# EAGLE design MultiSensor_MPL_TCA_0805 (EAGLE 9.5.2)
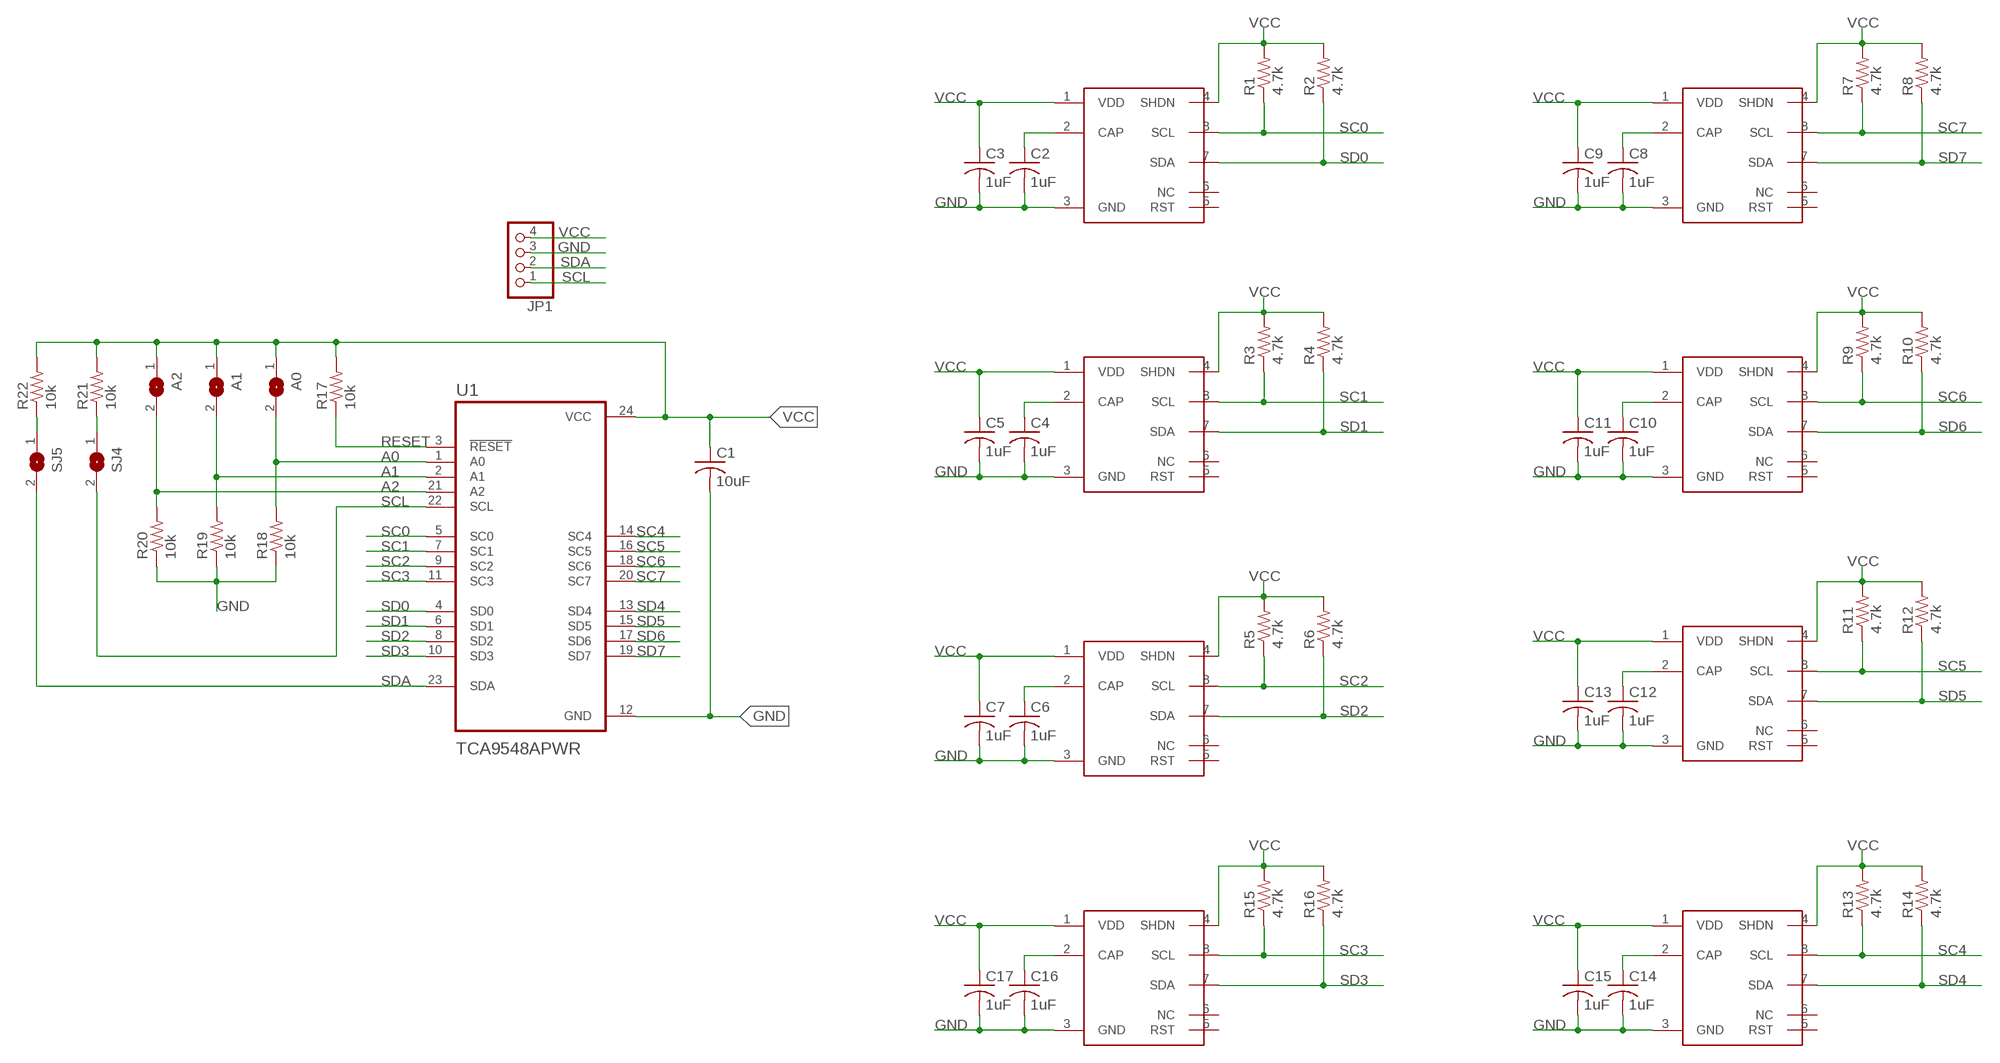
[diagram p0: schematic, sheet 1]

## Parts
A0  SJ  [SJ]
A1  SJ  [SJ]
A2  SJ  [SJ]
B1  MPL115A2T1  [MPL115A2T1]
B2  MPL115A2T1  [MPL115A2T1]
B3  MPL115A2T1  [MPL115A2T1]
B4  MPL115A2T1  [MPL115A2T1]
B5  MPL115A2T1  [MPL115A2T1]
B6  MPL115A2T1  [MPL115A2T1]
B7  MPL115A2T1  [MPL115A2T1]
B8  MPL115A2T1  [MPL115A2T1]
C1  10uF  C-USC1206  [C1206]
C2  1uF  C-USC0805  [C0805]
C3  1uF  C-USC0805  [C0805]
C4  1uF  C-USC0805  [C0805]
C5  1uF  C-USC0805  [C0805]
C6  1uF  C-USC0805  [C0805]
C7  1uF  C-USC0805  [C0805]
C8  1uF  C-USC0805  [C0805]
C9  1uF  C-USC0805  [C0805]
C10  1uF  C-USC0805  [C0805]
C11  1uF  C-USC0805  [C0805]
C12  1uF  C-USC0805  [C0805]
C13  1uF  C-USC0805  [C0805]
C14  1uF  C-USC0805  [C0805]
C15  1uF  C-USC0805  [C0805]
C16  1uF  C-USC0805  [C0805]
C17  1uF  C-USC0805  [C0805]
JP1  PINHD-1X4  [1X04]
R1  4.7k  R-US_R0805  [R0805]
R2  4.7k  R-US_R0805  [R0805]
R3  4.7k  R-US_R0805  [R0805]
R4  4.7k  R-US_R0805  [R0805]
R5  4.7k  R-US_R0805  [R0805]
R6  4.7k  R-US_R0805  [R0805]
R7  4.7k  R-US_R0805  [R0805]
R8  4.7k  R-US_R0805  [R0805]
R9  4.7k  R-US_R0805  [R0805]
R10  4.7k  R-US_R0805  [R0805]
R11  4.7k  R-US_R0805  [R0805]
R12  4.7k  R-US_R0805  [R0805]
R13  4.7k  R-US_R0805  [R0805]
R14  4.7k  R-US_R0805  [R0805]
R15  4.7k  R-US_R0805  [R0805]
R16  4.7k  R-US_R0805  [R0805]
R17  10k  R-US_R0805  [R0805]
R18  10k  R-US_R0805  [R0805]
R19  10k  R-US_R0805  [R0805]
R20  10k  R-US_R0805  [R0805]
R21  10k  R-US_R0805  [R0805]
R22  10k  R-US_R0805  [R0805]
SJ4  SJ  [SJ]
SJ5  SJ  [SJ]
U1  TCA9548APWR  [SOP65P640X120-24N]

## Nets
A0: A0.2 R18.2 U1.1(A0)
A1: A1.2 R19.2 U1.2(A1)
A2: A2.2 R20.2 U1.21(A2)
CAP1: B1.2(CAP) C2.1
CAP2: B2.2(CAP) C4.1
CAP3: B3.2(CAP) C6.1
CAP4: B8.2(CAP) C16.1
CAP5: B7.2(CAP) C14.1
CAP6: B6.2(CAP) C12.1
CAP7: B5.2(CAP) C10.1
CAP8: B4.2(CAP) C8.1
GND: B1.3(GND) B2.3(GND) B3.3(GND) B4.3(GND) B5.3(GND) B6.3(GND) B7.3(GND) B8.3(GND) C1.2 C2.2 C3.2 C4.2 C5.2 C6.2 C7.2 C8.2 C9.2 C10.2 C11.2 C12.2 C13.2 C14.2 C15.2 C16.2 C17.2 JP1.3 R18.1 R19.1 R20.1 U1.12(GND)
N$1: R22.1 SJ5.1
N$2: R21.1 SJ4.1
RESET: R17.1 U1.3(!RESET)
SC0: B1.8(SCL) R1.1 U1.5(SC0)
SC1: B2.8(SCL) R3.1 U1.7(SC1)
SC2: B3.8(SCL) R5.1 U1.9(SC2)
SC3: B8.8(SCL) R15.1 U1.11(SC3)
SC4: B7.8(SCL) R13.1 U1.14(SC4)
SC5: B6.8(SCL) R11.1 U1.16(SC5)
SC6: B5.8(SCL) R9.1 U1.18(SC6)
SC7: B4.8(SCL) R7.1 U1.20(SC7)
SCL: JP1.1 SJ4.2 U1.22(SCL)
SD0: B1.7(SDA) R2.1 U1.4(SD0)
SD1: B2.7(SDA) R4.1 U1.6(SD1)
SD2: B3.7(SDA) R6.1 U1.8(SD2)
SD3: B8.7(SDA) R16.1 U1.10(SD3)
SD4: B7.7(SDA) R14.1 U1.13(SD4)
SD5: B6.7(SDA) R12.1 U1.15(SD5)
SD6: B5.7(SDA) R10.1 U1.17(SD6)
SD7: B4.7(SDA) R8.1 U1.19(SD7)
SDA: JP1.2 SJ5.2 U1.23(SDA)
VCC: A0.1 A1.1 A2.1 B1.1(VDD) B1.4(SHDN) B2.1(VDD) B2.4(SHDN) B3.1(VDD) B3.4(SHDN) B4.1(VDD) B4.4(SHDN) B5.1(VDD) B5.4(SHDN) B6.1(VDD) B6.4(SHDN) B7.1(VDD) B7.4(SHDN) B8.1(VDD) B8.4(SHDN) C1.1 C3.1 C5.1 C7.1 C9.1 C11.1 C13.1 C15.1 C17.1 JP1.4 R1.2 R2.2 R3.2 R4.2 R5.2 R6.2 R7.2 R8.2 R9.2 R10.2 R11.2 R12.2 R13.2 R14.2 R15.2 R16.2 R17.2 R21.2 R22.2 U1.24(VCC)
Unconnected: B1.5(RST) B1.6(NC) B2.5(RST) B2.6(NC) B3.5(RST) B3.6(NC) B4.5(RST) B4.6(NC) B5.5(RST) B5.6(NC) B6.5(RST) B6.6(NC) B7.5(RST) B7.6(NC) B8.5(RST) B8.6(NC)

## Library data of the parts
A0 A1 A2 SJ4 SJ5 = jumper:SJ: SMD solder JUMPER
B1-B8 = MPL115A2T1:MPL115A2T1: MEMS Barometer from NXP Semiconductors. DATASHEET: https://www.nxp.com/docs/en/data-sheet/MPL115A2.pdf
C1-C17 = rcl:C-US: CAPACITOR, American symbol; SPICEPREFIX: C
JP1 = pinhead:PINHD-1X4: PIN HEADER
R1-R16 = rcl:R-US_: RESISTOR, American symbol; SPICEPREFIX: R
R17-R22 = resistor:R-US_: RESISTOR, American symbol
U1 = TCA9548APWR:TCA9548APWR; DESCRIPTION: Low-Voltage 8-Channel I2C Switch With Reset 24-TSSOP -40 to 85; DIGI-KEY_PART_NUMBER: 296-34905-1-ND; MF: Texas Instruments; MP: TCA9548APWR; PACKAGE: TSSOP-24 Texas Instruments; PURCHASE-URL: https://pricing.snapeda.com/search/part/TCA9548APWR/?ref=eda

## Board
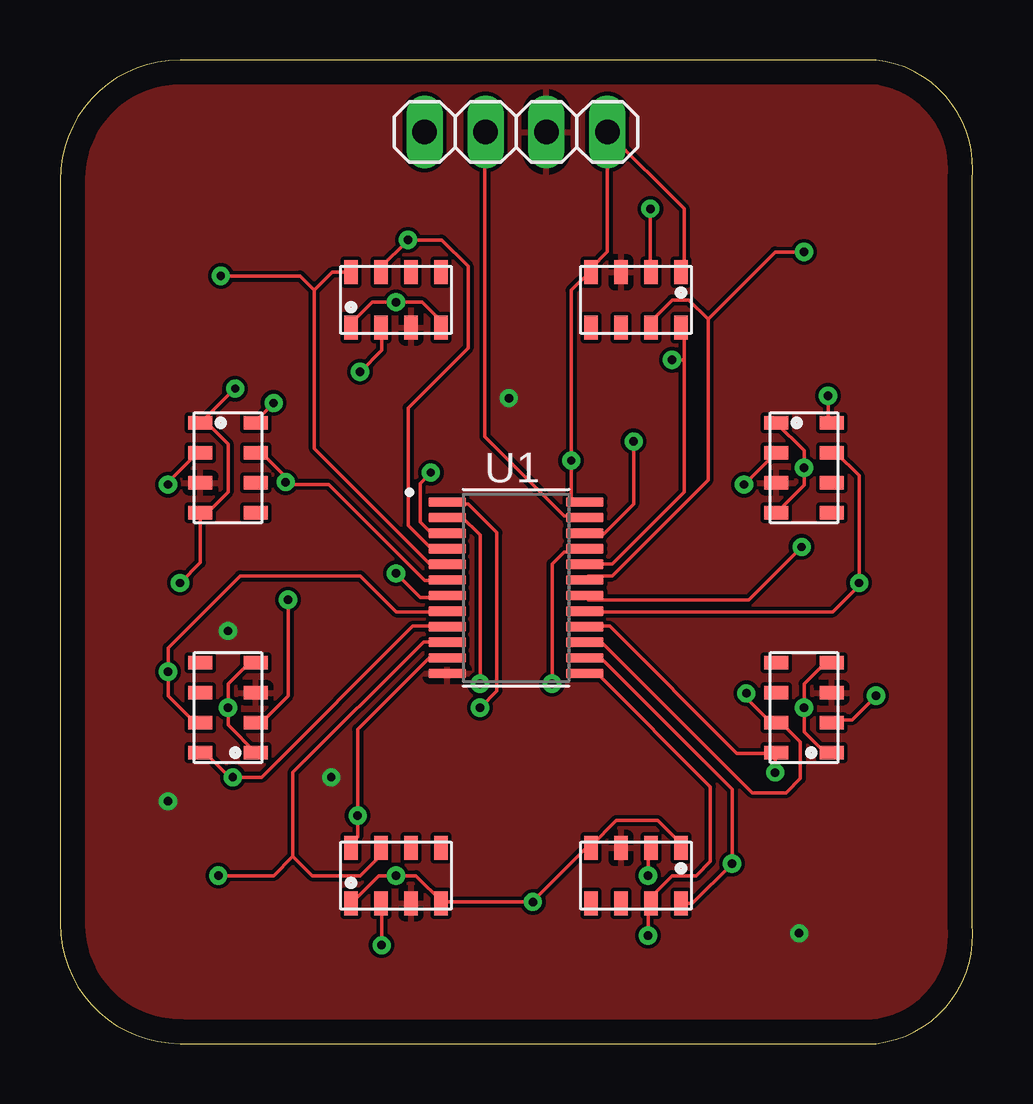
[diagram p1: board, top side]
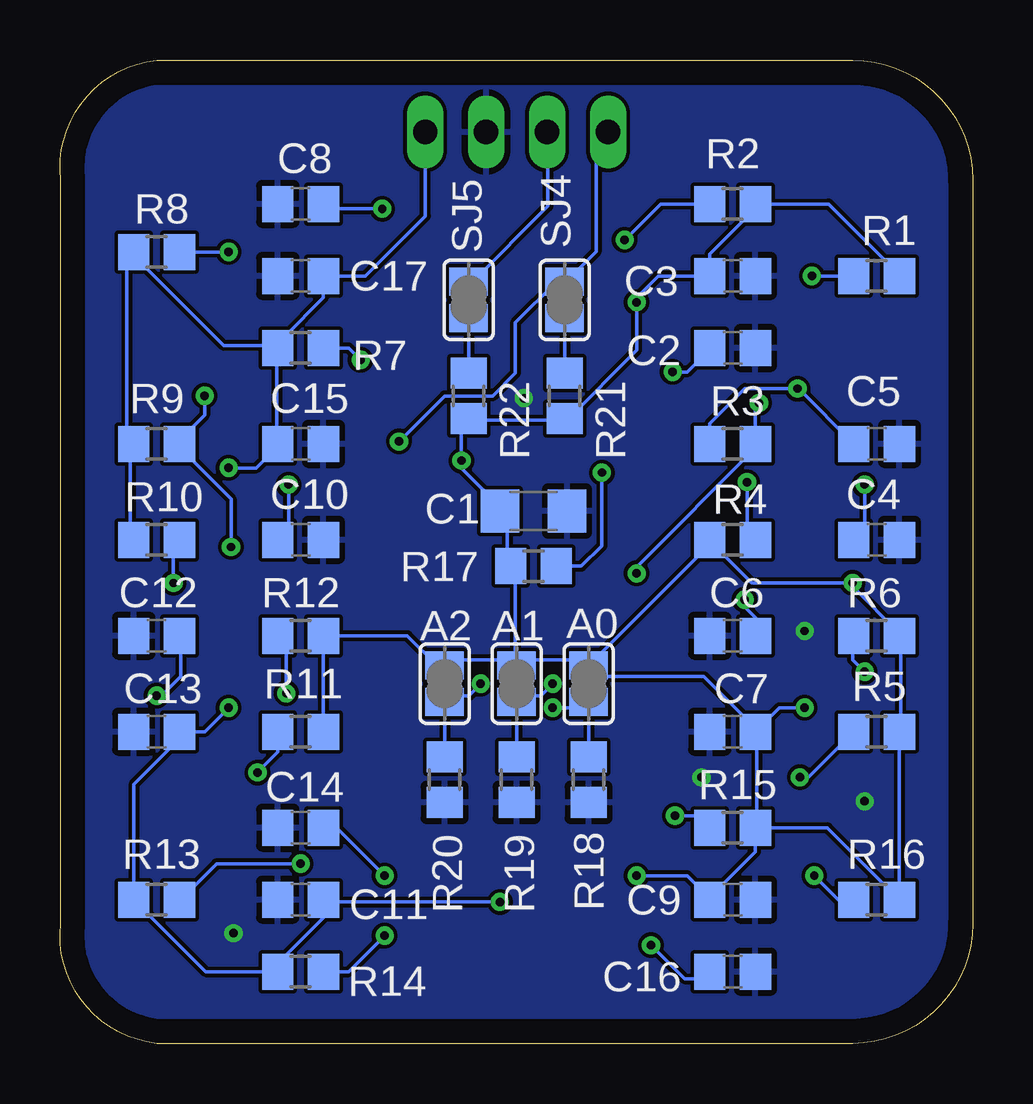
[diagram p2: board, bottom side, seen from below]

Size 38.03 x 41 mm. Coordinates in mm from the lower left corner, seen from the top.
Outline: 0,36 0,5 arc90 5,0 34,0 arc90 38,5 38,36 arc90 34,41 5,41 arc90 0,36
Copper layers (1*16): Top 0.035mm / dielectric 1.5mm / Bottom 0.035mm
Design rules "default": minimum track width 6mil, minimum drill 0.35mm, track to track 6mil, track to pad 6mil, pad to pad 6mil, via to via 6mil, smd to smd 6mil, copper to edge 40mil, drill to drill 6mil, minimum pad ring 10mil, minimum via ring 8mil, stop-mask expansion 4mil, vias tented up to drill 0mil, thermal gap 10mil

### Footprints (pad centres in the part's own frame; a part is rotated, then mirrored left to right if it is on the bottom)
SJ = smd 1.168 x 1.6: 1 -0.762,0; 2 0.762,0
MPL115A2T1 = smd 1 x 0.55: 1 -1.15,1.875; 2 -1.15,0.625; 3 -1.15,-0.625; 4 -1.15,-1.875; 5 1.15,-1.875; 6 1.15,-0.625; 7 1.15,0.625; 8 1.15,1.875
C1206 = smd 1.6 x 1.8: 1 -1.4,0; 2 1.4,0
C0805 = smd 1.3 x 1.5: 1 -0.95,0; 2 0.95,0
1X04 = drill 1.016 long: 1 -3.81,0; 2 -1.27,0; 3 1.27,0; 4 3.81,0
R0805 = smd 1.3 x 1.5: 1 -0.95,0; 2 0.95,0
SOP65P640X120-24N = smd 1.57 x 0.41: 1 -2.87,3.575; 2 -2.87,2.925; 3 -2.87,2.275; 4 -2.87,1.625; 5 -2.87,0.975; 6 -2.87,0.325; 7 -2.87,-0.325; 8 -2.87,-0.975; 9 -2.87,-1.625; 10 -2.87,-2.275; 11 -2.87,-2.925; 12 -2.87,-3.575; 13 2.87,-3.575; 14 2.87,-2.925; 15 2.87,-2.275; 16 2.87,-1.625; 17 2.87,-0.975; 18 2.87,-0.325; 19 2.87,0.325; 20 2.87,0.975; 21 2.87,1.625; 22 2.87,2.275; 23 2.87,2.925; 24 2.87,3.575

### Placement (x,y rotation side)
A0  16,15 270 bottom
A1  19,15 270 bottom
A2  22,15 270 bottom
B1  14,31 90 top
B2  7,24 0 top
B3  7,14 180 top
B4  24,31 270 top
B5  31,24 0 top
B6  31,14 180 top
B7  24,7 270 top
B8  14,7 90 top
C1  18.3,22.2 0 bottom
C2  10,29 0 bottom
C3  10,32 0 bottom
C4  4,21 0 bottom
C5  4,25 0 bottom
C6  10,17 180 bottom
C7  10,13 180 bottom
C8  28,35 180 bottom
C9  10,6 0 bottom
C10  28,21 0 bottom
C11  28,6 180 bottom
C12  34,17 180 bottom
C13  34,13 180 bottom
C14  28,9 180 bottom
C15  28,25 0 bottom
C16  10,3 0 bottom
C17  28,32 180 bottom
JP1  19,38 0 top
R1  4,32 0 bottom
R2  10,35 0 bottom
R3  10,25 180 bottom
R4  10,21 180 bottom
R5  4,13 0 bottom
R6  4,17 0 bottom
R7  28,29 180 bottom
R8  34,33 180 bottom
R9  34,25 180 bottom
R10  34,21 180 bottom
R11  28,13 0 bottom
R12  28,17 0 bottom
R13  34,6 180 bottom
R14  28,3 180 bottom
R15  10,9 0 bottom
R16  4,6 0 bottom
R17  18.3,19.9 180 bottom
R18  16,11 90 bottom
R19  19,11 90 bottom
R20  22,11 90 bottom
R21  17,27 270 bottom
R22  21,27 270 bottom
SJ4  17,31 90 bottom
SJ5  21,31 90 bottom
U1  19,19 0 top

### Tracks (layer width: path | path; a pad name or v marks a point on that pad's centre or on a via)
A0  (via drill 0.35)
  Top 0.152: v17.5,14 18.2,14.7 18.2,21.3 17,22.5 16.2,22.5 U1.1
  Bottom 0.152: 16,14 R18.2 | 16,14 v17.5,14 | 16,14 A0.2
A1  (via drill 0.35)
  Top 0.152: v17.5,15 17.5,21.2 16.7,22 16.5,22 U1.2
  Bottom 0.152: R19.2 A1.2 19,14.5 18,14.5 v17.5,15
A2  (via drill 0.35)
  Top 0.152: v20.5,15 20.5,20 21,20.5 21.5,20.5 U1.21
  Bottom 0.152: R20.2 A2.2 22,14.5 21,14.5 v20.5,15
CAP1  (via drill 0.35)
  Top 0.152: v12.5,28 13.4,28.9 13.4,29.78 B1.2
  Bottom 0.152: C2.1 10.95,28.95 11.9,28 v12.5,28
CAP2  (via drill 0.35)
  Top 0.152: v4.5,23.3 4.45,23.35 5.66,24.56 B2.2
  Bottom 0.152: C4.1 4.5,21.45 v4.5,23.3
CAP3  (via drill 0.35)
  Top 0.152: v9.5,18.5 9.5,14.5 8.5,13.5 B3.2
  Bottom 0.152: v9.5,18.5 9.5,18.2 9,17.7 9,17 C6.1
CAP4  (via drill 0.35)
  Top 0.152: B8.2 13.4,5.83 v13.4,4.1
  Bottom 0.152: C16.1 11.25,2.7 12,2.7 v13.4,4.1
CAP5  (via drill 0.35)
  Top 0.152: v24.5,7 24.5,8 B7.2
  Bottom 0.152: v24.5,7 26.5,9 C14.1
CAP6  (via drill 0.35)
  Top 0.152: v34,14.5 33,13.5 32.5,13.5 B6.2
  Bottom 0.152: v34,14.5 33.8,14.5 33,15.3 33,17 C12.1
CAP7  (via drill 0.35)
  Top 0.152: v28.5,23.3 29.82,24.62 B5.2
  Bottom 0.152: v28.5,23.3 28.5,21 C10.1
CAP8  (via drill 0.35)
  Top 0.152: v24.6,34.8 24.6,32.22 B4.2
  Bottom 0.152: C8.1 26.85,34.8 v24.6,34.8
GND  (via drill 0.35)
  other vias: 11.3,11.1 18.7,26.9 30.8,4.6 7,17.2 4.5,10.1
  pour Bottom: 0,41 0,0 39,0 39,41
  pour Top: 0,41 0,0 39,0 39,41
N$1
  Bottom 0.152: SJ5.1 R22.1
N$2
  Bottom 0.152: SJ4.1 R21.1
RESET  (via drill 0.35)
  Top 0.152: v15.45,23.8 15,23.35 15,21.75 15.5,21.25 16,21.25 U1.3
  Bottom 0.152: R17.1 16.3,19.9 15.45,20.75 v15.45,23.8
SC0  (via drill 0.35)
  Top 0.152: B1.8 11.35,32.15 10.6,31.4 | 10.6,31.4 10.6,24.8 15.4,20 16,20 U1.5 | v6.7,32 10,32 10.6,31.4
  Bottom 0.152: R1.1 v6.7,32
SC1  (via drill 0.35)
  Top 0.152: v8.9,26.7 8.15,25.95 B2.8 | v14,19.6 15,18.6 16.07,18.6 U1.7
  Bottom 0.152: v14,19.6 14,19.87 9.05,24.82 R3.1 9.05,26.55 v8.9,26.7
SC2  (via drill 0.35)
  Top 0.152: U1.9 16.1,17.4 14.7,17.4 8.4,11.1 v7.2,11.1 7.08,11.1 6.05,12.12 B3.8
  Bottom 0.152: R5.1 6.85,11.1 v7.2,11.1
SC3  (via drill 0.35)
  Top 0.152: B8.8 12.12,8.35 12.4,8.62 v12.4,9.5 12.4,13.1 15.4,16.1 16.11,16.1 U1.11
  Bottom 0.152: v12.4,9.5 11.5,9.5 11,9 R15.1
SC4  (via drill 0.35)
  Top 0.152: U1.14 21.89,16.1 22.5,16.1 28,10.6 v28,7.5 26.35,5.85 B7.8
  Bottom 0.152: v28,7.5 31.5,7.5 33,6 R13.1
SC5  (via drill 0.35)
  Top 0.152: U1.16 21.9,17.4 22.9,17.4 28.2,12.1 29.82,12.1 B6.8 29.8,12.07 v29.8,11.3
  Bottom 0.152: R11.1 28.95,12.15 v29.8,11.3
SC6  (via drill 0.35)
  Top 0.152: v32,27 32,26 B5.8 | v30.9,20.7 28.7,18.5 22,18.5 U1.18
  Bottom 0.152: 33,25 R9.1 | v30.9,20.7 30.9,22.7 33,24.8 33,25 | v32,27 32,26.2 33,25.2 33,25
SC7  (via drill 0.35)
  Top 0.152: 26,28.5 26,23 23,20 22,20 U1.20 | 26,28.5 26,29.5 B4.8 | 26,28.5 v25.5,28.5
  Bottom 0.152: v25.5,28.5 26,29 R7.1
SCL  (via drill 0.35)
  Top 0.152: v23.9,25.1 23.9,22.5 22.65,21.25 22,21.25 U1.22
  Bottom 0.152: JP1.1 15.69,37.5 15.69,33.01 16.94,31.76 SJ4.2 17.35,31.75 19.05,30.05 19.05,27.95 20,27 22,27 v23.9,25.1
SD0  (via drill 0.35)
  Top 0.152: B1.7 13.3,32.23 13.3,32.3 v14.5,33.5 15.9,33.5 17,32.4 17,29 14.5,26.5 14.5,21.6 15.5,20.6 16.1,20.6 U1.4
  Bottom 0.152: v14.5,33.5 13,35 R2.1
SD1  (via drill 0.35)
  Top 0.152: U1.6 16.11,19.3 15.2,19.3 11.2,23.3 9.4,23.3 v9.4,23.4 9.3,23.5 9.3,23.72 8.4,24.62 B2.7
  Bottom 0.152: v9.4,23.4 9.4,21.35 R4.1
SD2  (via drill 0.35)
  Top 0.152: B3.7 5.5,13.5 4.5,14.5 v4.5,15.5 4.5,16.5 7.5,19.5 12.5,19.5 14,18 16,18 U1.8
  Bottom 0.152: v4.5,15.5 5,16 5,17 R6.1
SD3  (via drill 0.35)
  Top 0.152: B8.7 13.5,8 12.5,7 10.5,7 9.7,7.8 | U1.10 16,16.75 15.15,16.75 9.7,11.3 9.7,7.8 | 9.7,7.8 8.9,7 v6.6,7
  Bottom 0.152: v6.6,7 5.6,6 R16.1
SD4  (via drill 0.35)
  Top 0.152: v24.5,4.5 24.5,5.5 B7.7 24.5,6 25.5,7 26.5,7 27.1,7.6 27.1,10.7 22.38,15.43 U1.13
  Bottom 0.152: v24.5,4.5 26,3 R14.1
SD5  (via drill 0.35)
  Top 0.152: v28.6,14.6 28.6,14.4 29.5,13.5 B6.7 30.05,13.38 30.85,12.57 30.85,11.05 30.25,10.45 28.85,10.45 22.55,16.75 22,16.75 U1.15
  Bottom 0.152: R12.1 28.6,17 v28.6,14.6
SD6  (via drill 0.35)
  Top 0.152: B5.7 32.35,24.62 33.3,23.68 v33.3,19.2 33.3,19.1 32.2,18 22,18 U1.17
  Bottom 0.152: R10.1 33.3,20.75 v33.3,19.2
SD7  (via drill 0.35)
  Top 0.152: 27,30.2 26.2,31 25.5,31 24.5,30 B4.7 | 27,30.2 27,23.5 23,19.5 22,19.5 U1.19 | 27,30.2 29.8,33 v31,33
  Bottom 0.152: v31,33 R8.1
SDA
  Top 0.152: U1.23 21.5,22 21,22 17.7,25.3 17.7,38 JP1.2
  Bottom 0.152: SJ5.2 20.84,31.76 17.7,34.9 17.7,38 JP1.2
VCC  (via drill 0.35)
  Top 0.152: B7.1 25.88,8.17 25.88,8.32 24.9,9.3 23.18,9.3 22.12,8.25 B7.4 21.93,8.15 19.7,5.92 v19.7,5.9 15.93,5.9 | B3.1 7,13.28 v7,14 7,15 8,16 B3.4 | B4.1 26,32.5 26,34.81 JP1.4 22.81,33.01 22.12,32.33 B4.4 22.11,32.2 21.3,31.4 v21.3,24.3 21.3,22.57 U1.24 | B1.1 12.12,30.02 13,30.9 v14,30.9 15.1,30.9 16,30 B1.4 | B6.1 32,12 31,13 v31,14 31,15 32,16 B6.4 | v7.3,27.3 7.28,27.3 B2.1 6,26 7,25 7,23 6,22 B2.4 5.85,20.05 v5,19.2 | B8.4 15.93,5.9 | B5.4 31,23.27 v31,24 31,24.73 B5.1 | B8.1 13.28,7 v14,7 14.82,7 15.93,5.9
  Bottom 0.152: 9,13 9,9 R15.2 | R10.2 35.1,21 35.1,25 R9.2 35.25,25.3 35.25,33.15 34.95,32.85 | R7.2 29,29 29,25 C15.1 28.95,24.9 29.85,24 v31,24 | R1.2 3,32 6,35 R2.2 9.05,34.8 10.95,32.9 C3.1 13.1,32 14,31.1 v14,30.9 14,28.9 16.9,26 17,26 | v31,14 32,13 C13.1 33.05,12.7 34.95,10.8 R13.2 31.95,3 29.3,3 | 20.5,26 21,26 R22.2 | 20.5,26 17,26 | 19,16 16,16 A0.1 | 19,16 22,16 A2.1 22.31,15.76 23.55,17 R12.2 R11.2 | 19,16 A1.1 19.05,15.81 19.05,19.7 R17.2 19.4,20.05 19.4,22.2 19.5,22.2 | 20.5,26 R22.2 | 19.5,22.2 C1.1 | 17,26 R21.2 | JP1.4 22.8,34.5 25.3,32 C17.1 27.05,31.1 28.65,29.5 28.65,29.3 R7.2 | 9,13 9,13.1 11.2,15.3 16,15.3 A0.1 | 9,13 C7.1 8.05,14 v7,14 | 29.3,3 R14.2 | 29.3,3 27.05,5.25 C11.1 26.95,5.9 v19.7,5.9 | C9.1 11,6 11,6.05 | 11,6.05 11,6.1 11.9,7 v14,7 | 11,6.05 9.05,8 R15.2 | R15.2 6.05,9 R16.2 R5.2 3,13 3,17 R6.2 3.05,17.1 5,19.05 v5,19.2 9.2,19.2 11,21 R4.2 10.95,20.8 15.99,15.76 A0.1 | R8.2 34.95,32.85 | R3.2 10.95,25.85 9.49,27.31 v7.31,27.31 v7.3,27.3 7.25,27.3 C5.1 | R7.2 29.05,29.1 31.2,29.1 34.95,32.85 | R22.2 21.3,25.75 v21.3,24.3 21.3,24 19.5,22.2

### Text on the board
tDocu: SCL | SDA | GND | VCC